# EAGLE design picduino2 (EAGLE 5.06)
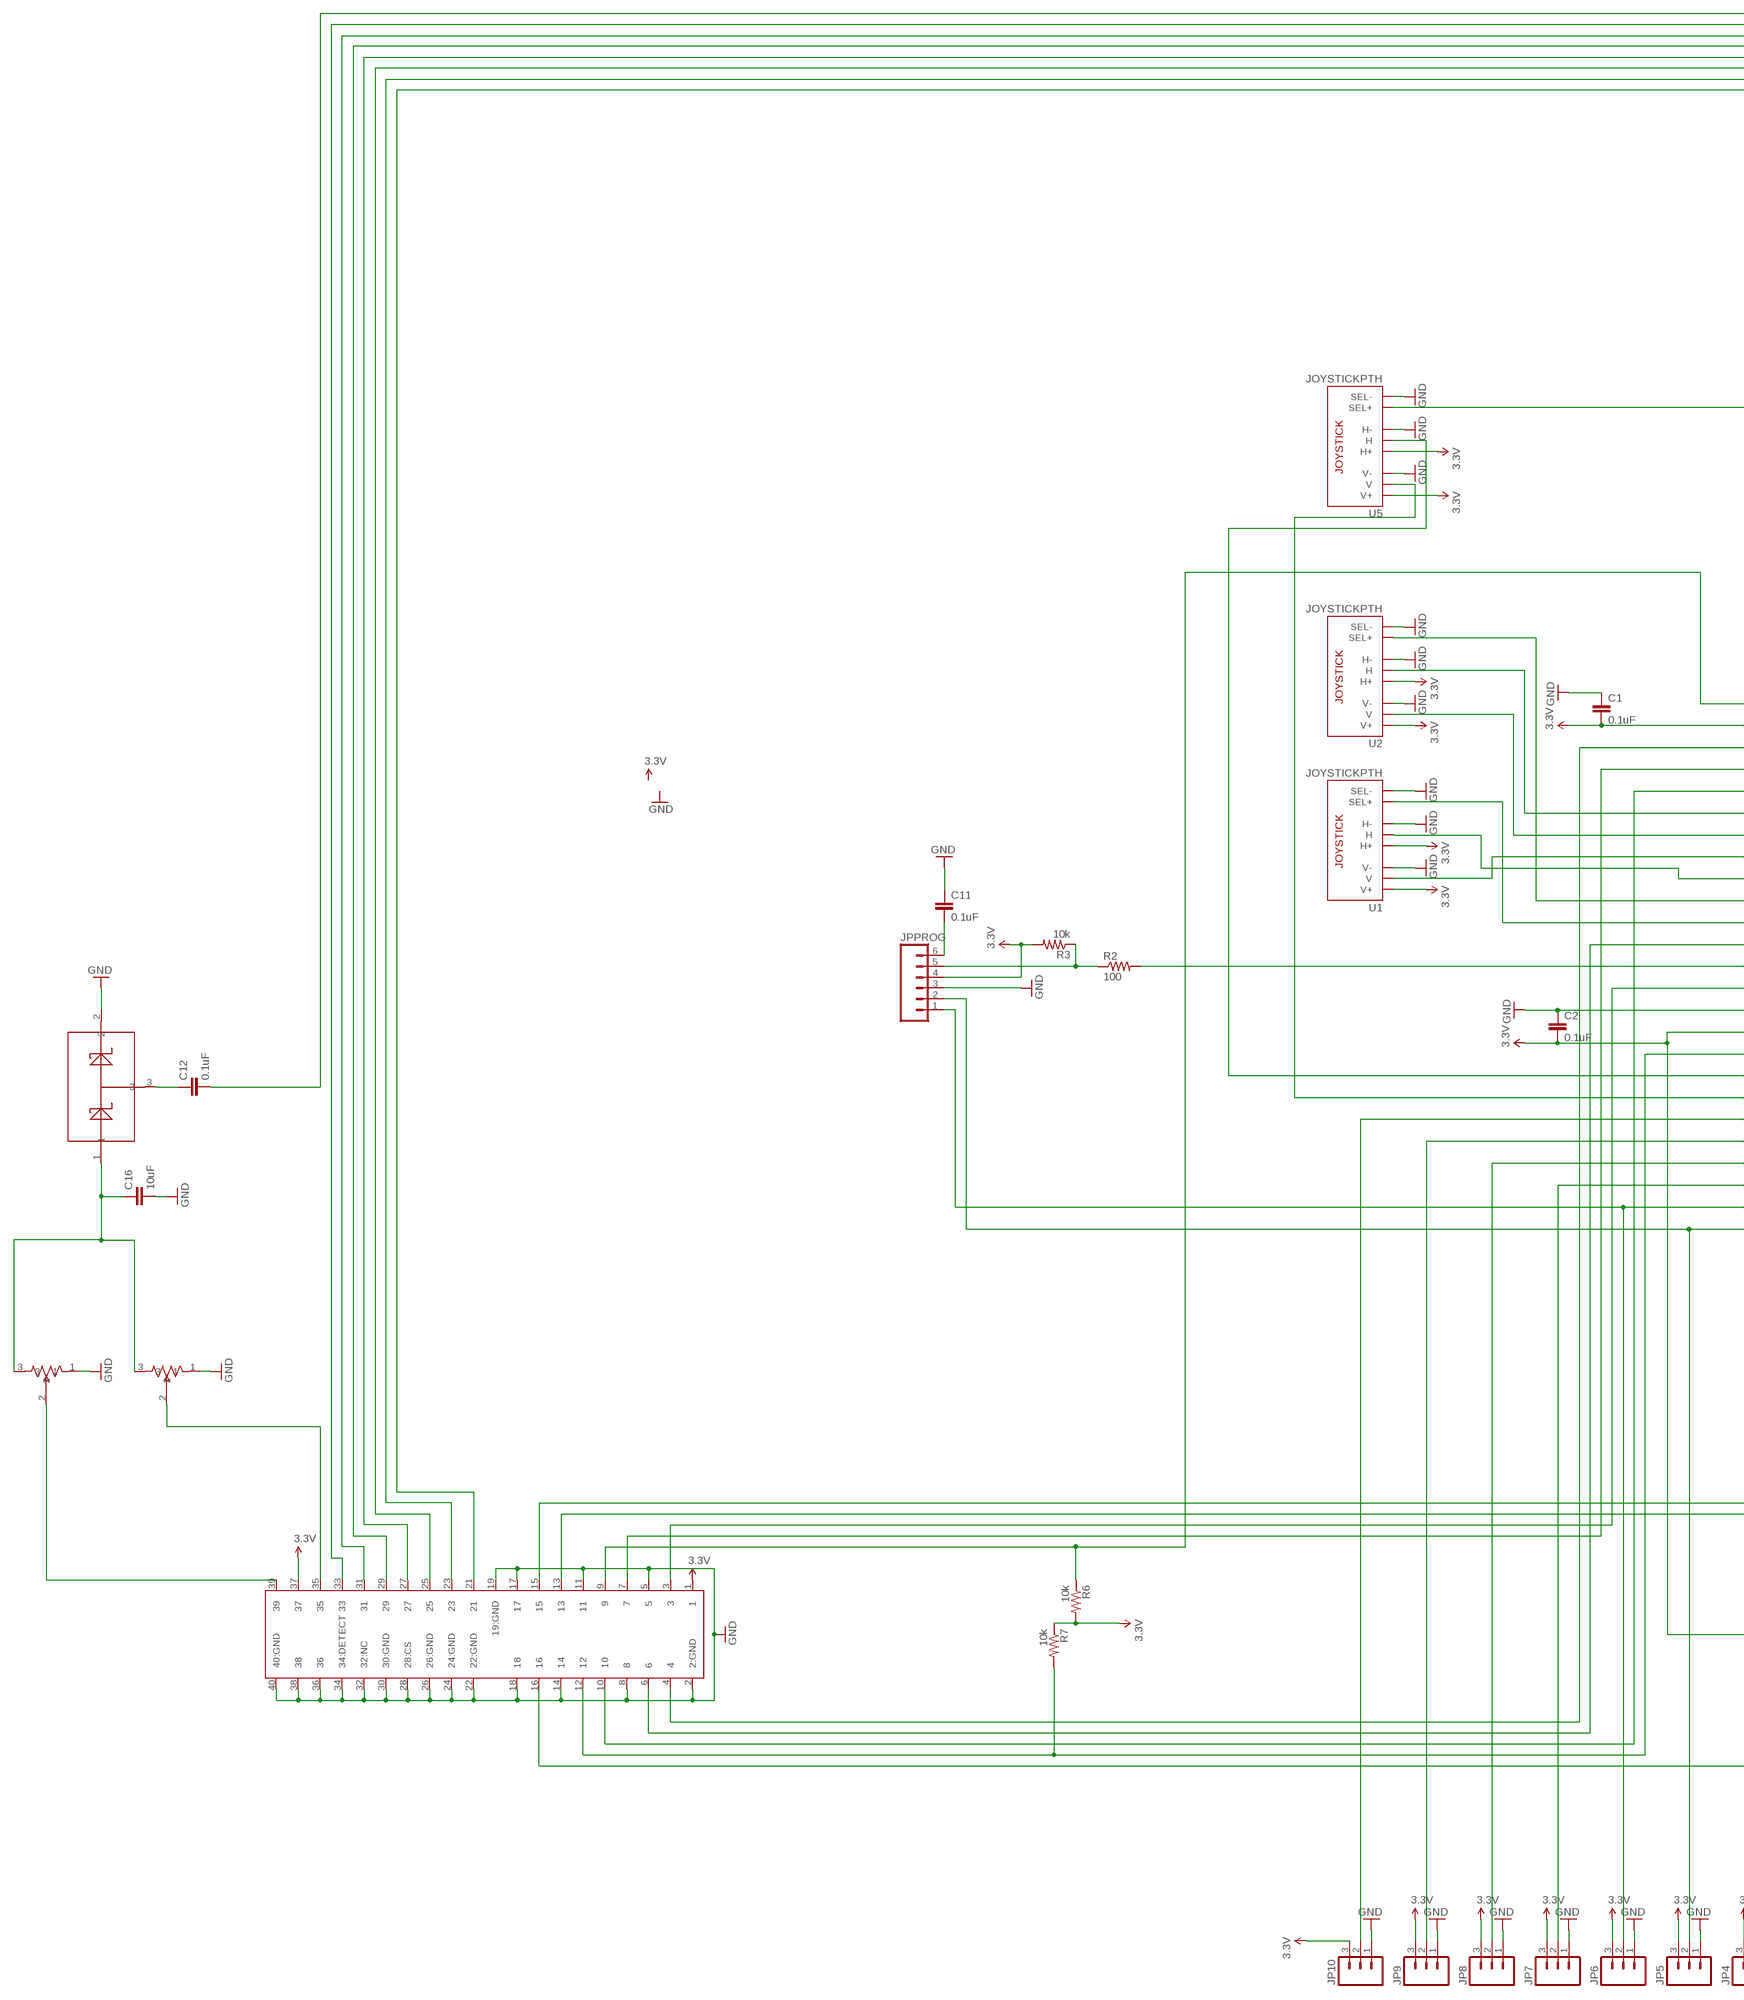
[diagram p0: schematic, sheet 1, part 1 of 2]
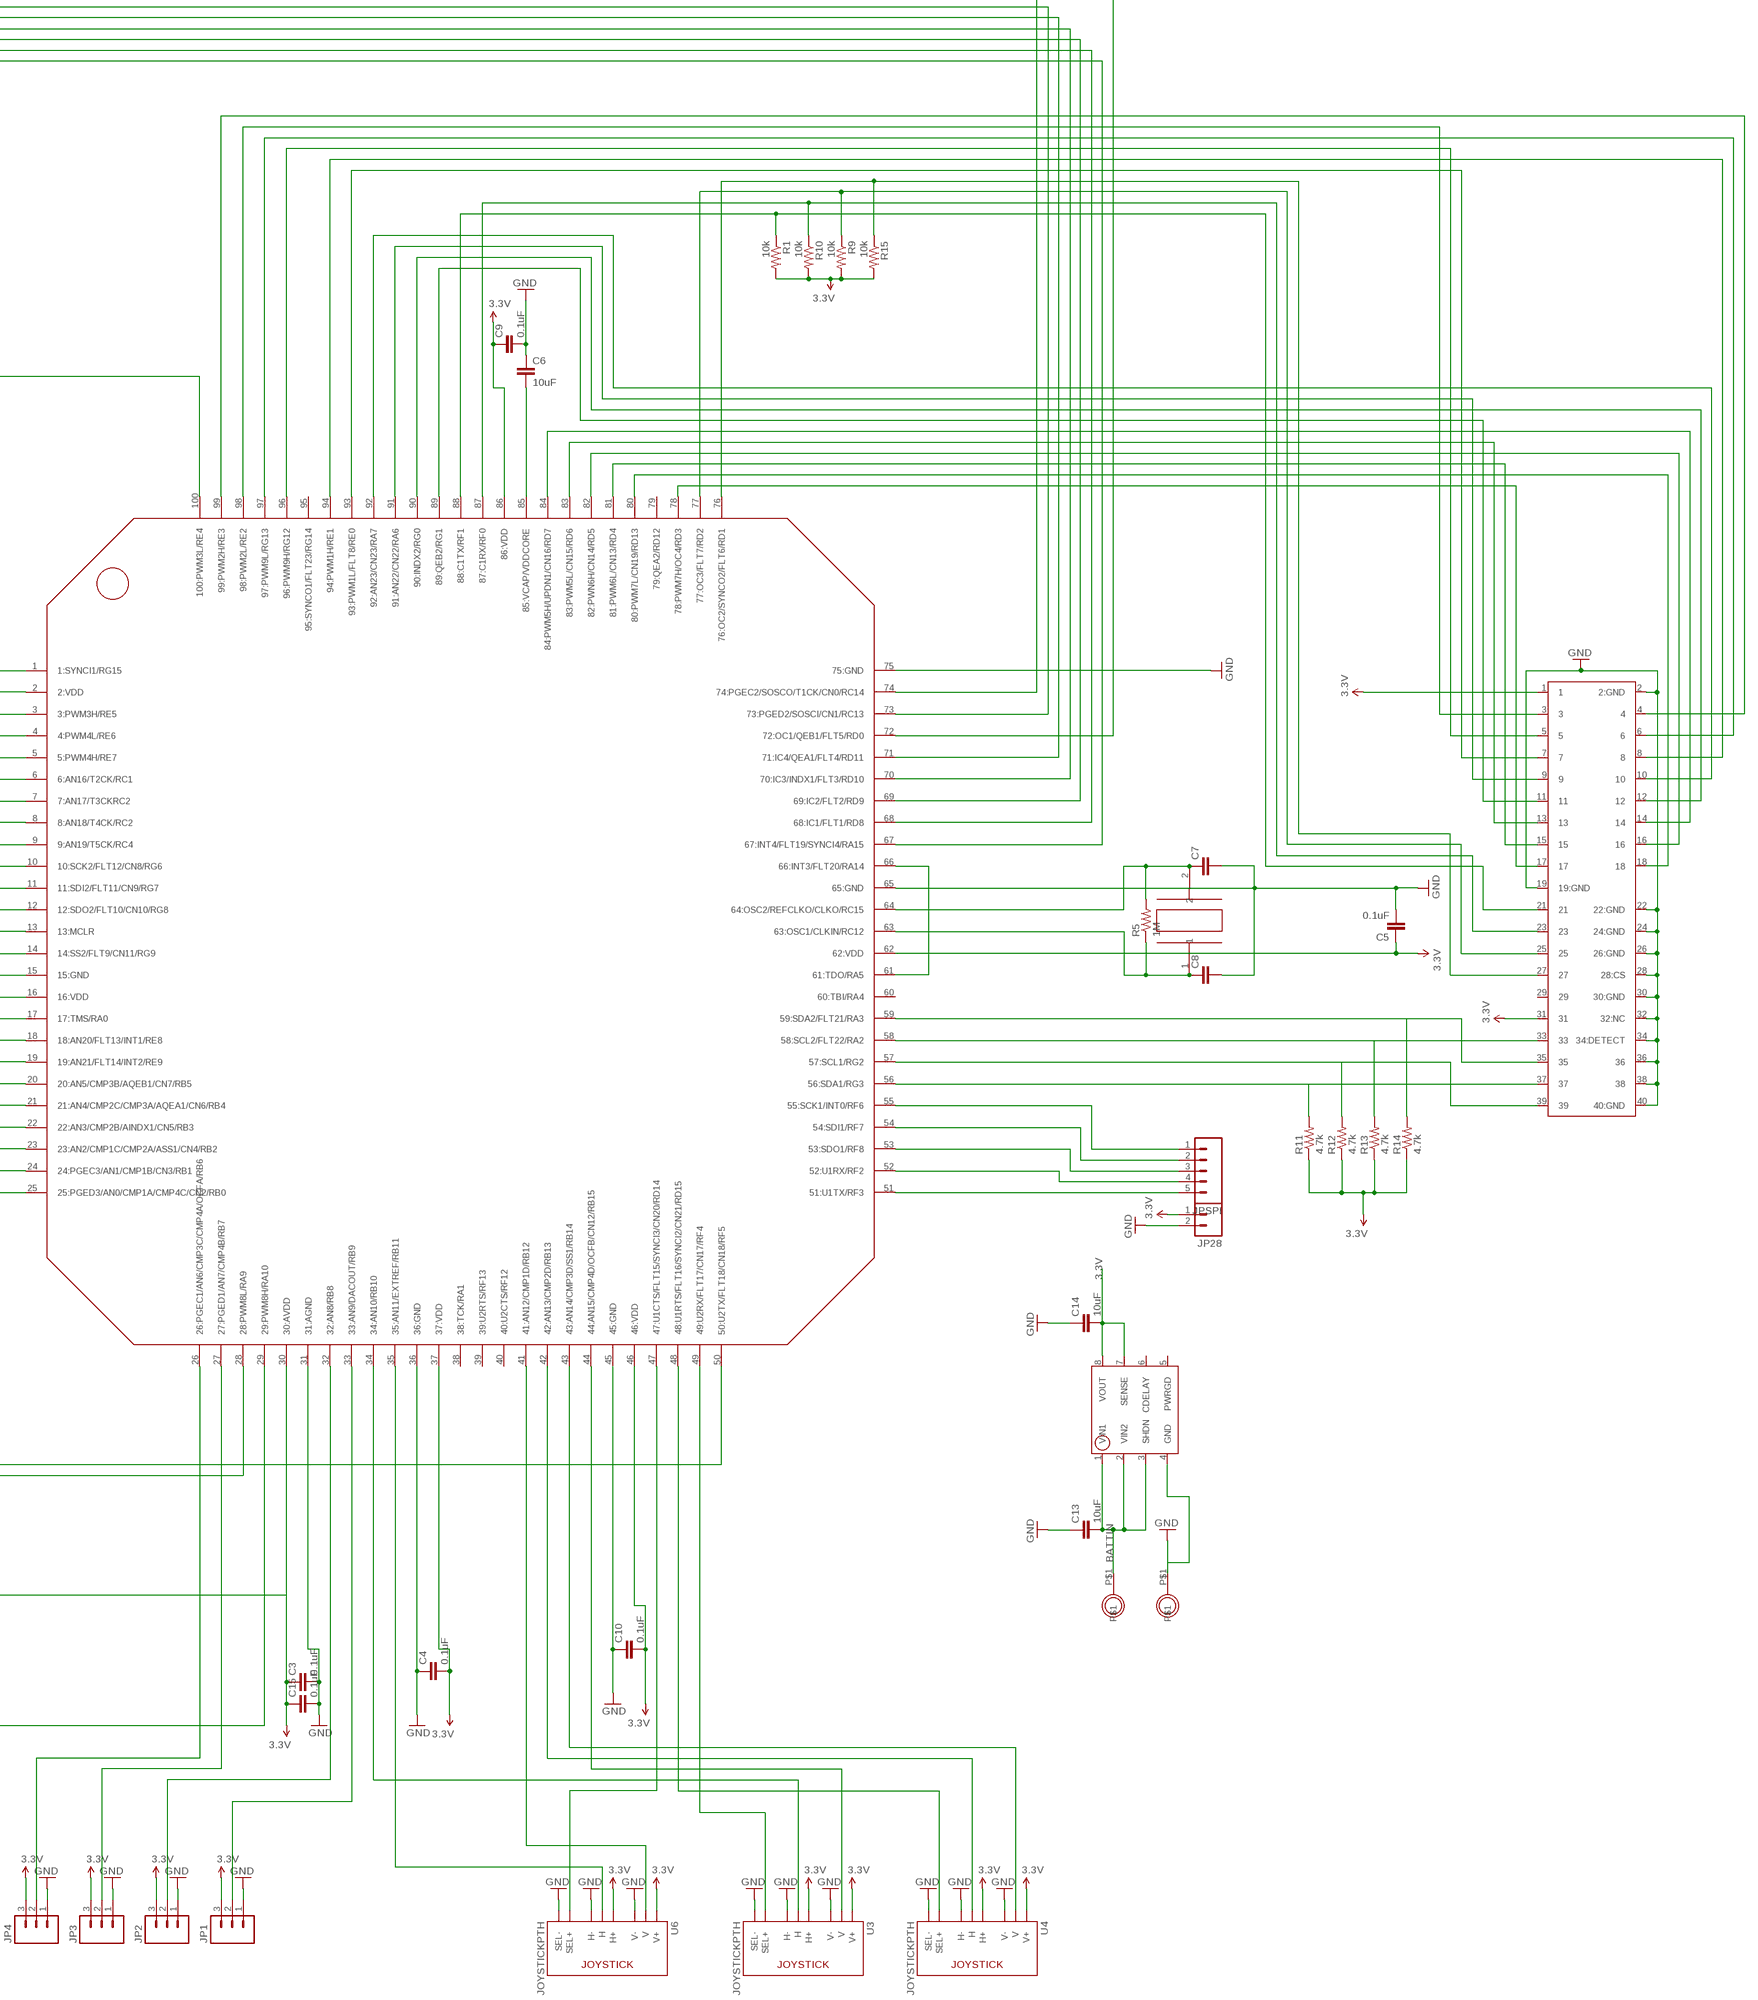
[diagram p1: schematic, sheet 1, part 2 of 2]

## Parts
+  THROUGH_HOLE_1MM  [THROUGH_HOLE_1MM]
-  THROUGH_HOLE_1MM  [THROUGH_HOLE_1MM]
C1  0.1uF  CAP0805  [0805]
C2  0.1uF  CAP0805  [0805]
C3  0.1uF  CAP0805  [0805]
C4  0.1uF  CAP0805  [0805]
C5  0.1uF  CAP0805  [0805]
C6  10uF  CAP0805  [0805]
C7  CAP0402-CAP  [0402-CAP]
C8  CAP0402-CAP  [0402-CAP]
C9  0.1uF  CAP0805  [0805]
C10  0.1uF  CAP0805  [0805]
C11  0.1uF  CAP0805  [0805]
C12  0.1uF  CAP0805  [0805]
C13  10uF  CAP0805  [0805]
C14  10uF  CAP0805  [0805]
C15  0.1uF  CAP0805  [0805]
C16  10uF  CAP0805  [0805]
JP1  M03LOCK  [1X03_LOCK]
JP2  M03LOCK  [1X03_LOCK]
JP3  M03LOCK  [1X03_LOCK]
JP4  M03LOCK  [1X03_LOCK]
JP5  M03LOCK  [1X03_LOCK]
JP6  M03LOCK  [1X03_LOCK]
JP7  M03LOCK  [1X03_LOCK]
JP8  M03LOCK  [1X03_LOCK]
JP9  M03LOCK  [1X03_LOCK]
JP10  M03LOCK  [1X03_LOCK]
JP28  M02LOCK  [1X02_LOCK]
JPPROG  M06LOCK  [1X06_LOCK]
JPSPI  M05LOCK  [1X05_LOCK]
R1  10k  RESISTOR  [0805]
R2  100  RESISTOR  [0805]
R3  10k  RESISTOR  [0805]
R5  1M  RESISTOR  [0805]
R6  10k  RESISTOR  [0805]
R7  10k  RESISTOR  [0805]
R9  10k  RESISTOR  [0805]
R10  10k  RESISTOR  [0805]
R11  4.7k  RESISTOR  [0805]
R12  4.7k  RESISTOR  [0805]
R13  4.7k  RESISTOR  [0805]
R14  4.7k  RESISTOR  [0805]
R15  10k  RESISTOR  [0805]
U1  JOYSTICKPTH  [JOYSTICK]
U2  JOYSTICKPTH  [JOYSTICK]
U3  JOYSTICKPTH  [JOYSTICK]
U4  JOYSTICKPTH  [JOYSTICK]
U5  JOYSTICKPTH  [JOYSTICK]
U6  JOYSTICKPTH  [JOYSTICK]
U$2  BAS40-04  [SOT23]
U$3  HC49US  [HC49US]
U$4  IDEATTACH  [IDEATTACH]
U$6  PIC33FJGS610-14X14  [TQFP100-14X14]
U$10  TRIMPOT3319  [TRIMPOT3319]
U$11  TRIMPOT3319  [TRIMPOT3319]
U$12  IDEATTACH  [IDEATTACH]
U$16  MCP1725  [SOIC8]

## Nets
3.3V: C1.2 C2.2 C3.1 C4.2 C5.1 C9.1 C10.2 C14.2 C15.1 JP1.3 JP2.3 JP3.3 JP4.3 JP5.3 JP6.3 JP7.3 JP8.3 JP9.3 JP10.3 JP28.1 JPPROG.4 R1.2 R3.2 R6.2 R7.1 R9.2 R10.2 R11.1 R12.1 R13.1 R14.1 R15.2 U1.H1(H+) U1.V1(V+) U2.H1(H+) U2.V1(V+) U3.H1(H+) U3.V1(V+) U4.H1(H+) U4.V1(V+) U5.H1(H+) U5.V1(V+) U6.H1(H+) U6.V1(V+) U$4.1 U$4.37 U$6.2(2:VDD) U$6.16(16:VDD) U$6.30(30:AVDD) U$6.37(37:VDD) U$6.46(46:VDD) U$6.62(62:VDD) U$6.86(86:VDD) U$12.1 U$12.31 U$16.7(SENSE) U$16.8(VOUT)
BATTIN: +.P$1 C13.2 U$16.1(VIN1) U$16.2(VIN2) U$16.3(SHDN)
CHARGEPUMP: C16.1 U$2.1 U$10.3 U$11.3
CHARGEPUMPPWM: C12.2 U$6.72(72:OC1/QEB1/FLT5/RD0)
GND: -.P$1 C1.1 C2.1 C3.2 C4.1 C5.2 C6.1 C7.2 C8.2 C9.2 C10.1 C11.1 C13.1 C14.1 C15.2 C16.2 JP1.1 JP2.1 JP3.1 JP4.1 JP5.1 JP6.1 JP7.1 JP8.1 JP9.1 JP10.1 JP28.2 JPPROG.3 U1.B2A(SEL-) U1.H3(H-) U1.V3(V-) U2.B2A(SEL-) U2.H3(H-) U2.V3(V-) U3.B2A(SEL-) U3.H3(H-) U3.V3(V-) U4.B2A(SEL-) U4.H3(H-) U4.V3(V-) U5.B2A(SEL-) U5.H3(H-) U5.V3(V-) U6.B2A(SEL-) U6.H3(H-) U6.V3(V-) U$2.2 U$4.2(2:GND) U$4.5 U$4.8 U$4.11 U$4.14 U$4.17 U$4.18 U$4.19(19:GND) U$4.22(22:GND) U$4.24(24:GND) U$4.26(26:GND) U$4.28(28:CS) U$4.30(30:GND) U$4.32(32:NC) U$4.34(34:DETECT) U$4.36 U$4.38 U$4.40(40:GND) U$6.15(15:GND) U$6.31(31:AGND) U$6.36(36:GND) U$6.45(45:GND) U$6.65(65:GND) U$6.75(75:GND) U$10.1 U$11.1 U$12.2(2:GND) U$12.19(19:GND) U$12.22(22:GND) U$12.24(24:GND) U$12.26(26:GND) U$12.28(28:CS) U$12.30(30:GND) U$12.32(32:NC) U$12.34(34:DETECT) U$12.36 U$12.38 U$12.40(40:GND) U$16.4(GND)
INT: JPSPI.4 U$6.52(52:U1RX/RF2)
J1S: U4.B1A(SEL+) U$6.48(48:U1RTS/FLT16/SYNCI2/CN21/RD15)
J1X: U4.H2(H) U$6.42(42:AN13/CMP2D/RB13)
J1Y: U4.V2(V) U$6.43(43:AN14/CMP3D/SS1/RB14)
J2S: U3.B1A(SEL+) U$6.49(49:U2RX/FLT17/CN17/RF4)
J2X: U3.H2(H) U$6.34(34:AN10/RB10)
J2Y: U3.V2(V) U$6.44(44:AN15/CMP4D/OCFB/CN12/RB15)
J3S: U1.B1A(SEL+) U$6.11(11:SDI2/FLT11/CN9/RG7)
J3X: U1.V2(V) U$6.8(8:AN18/T4CK/RC2)
J4S: U2.B1A(SEL+) U$6.10(10:SCK2/FLT12/CN8/RG6)
J4X: U2.H2(H) U$6.6(6:AN16/T2CK/RC1)
J4Y: U2.V2(V) U$6.7(7:AN17/T3CKRC2)
LCDD4: U$4.27 U$6.70(70:IC3/INDX1/FLT3/RD10)
LCDD5: U$4.25 U$6.69(69:IC2/FLT2/RD9)
LCDD6: U$4.23 U$6.68(68:IC1/FLT1/RD8)
LCDD7: U$4.21 U$6.67(67:INT4/FLT19/SYNCI4/RA15)
LCDDRIVE: U$4.35 U$11.2
LCDE: U$4.29 U$6.71(71:IC4/QEA1/FLT4/RD11)
LCDLED: U$4.39 U$10.2
LCDR/W: U$4.31 U$6.73(73:PGED2/SOSCI/CN1/RC13)
LCDRS: U$4.33 U$6.74(74:PGEC2/SOSCO/T1CK/CN0/RC14)
MCLR: R2.2 U$6.13(13:MCLR)
N$1: U$6.78(78:PWM7H/OC4/RD3) U$12.17
N$3: C12.1 U$2.3
N$4: JPPROG.5 R2.1 R3.1
N$5: U$6.80(80:PWM7L/CN19/RD13) U$12.18
N$6: U$6.81(81:PWM6L/CN13/RD4) U$12.15
N$7: R7.2 U$4.12 U$6.17(17:TMS/RA0)
N$9: U$6.82(82:PWN6H/CN14/RD5) U$12.16
N$10: U$4.16 U$6.29(29:PWM8H/RA10)
N$11: U$6.83(83:PWM5L/CN15/RD6) U$12.13
N$12: U$6.84(84:PWM5H/UPDN1/CN16/RD7) U$12.14
N$13: U$4.13 U$6.28(28:PWM8L/RA9)
N$14: U$4.15 U$6.50(50:U2TX/FLT18/CN18/RF5)
N$15: U$6.89(89:QEB2/RG1) U$12.11
N$16: U$6.90(90:INDX2/RG0) U$12.12
N$17: U$6.91(91:AN22/CN22/RA6) U$12.9
N$18: U$6.92(92:AN23/CN23/RA7) U$12.10
N$19: U$6.93(93:PWM1L/FLT8/RE0) U$12.7
N$20: U$6.94(94:PWM1H/RE1) U$12.8
N$21: U$6.96(96:PWM9H/RG12) U$12.5
N$23: U$6.97(97:PWM9L/RG13) U$12.6
N$24: U$6.98(98:PWM2L/RE2) U$12.3
N$25: U$6.99(99:PWM2H/RE3) U$12.4
N$26: U5.B1A(SEL+) U$6.100(100:PWM3L/RE4)
N$27: R1.1 U$6.88(88:C1TX/RF1) U$12.21
N$28: R10.1 U$6.87(87:C1RX/RF0) U$12.23
N$29: R9.1 U$6.77(77:OC3/FLT7/RD2) U$12.25
N$30: R15.1 U$6.76(76:OC2/SYNCO2/FLT6/RD1) U$12.27
N$31: U1.H2(H) U$6.9(9:AN19/T5CK/RC4)
N$32: U6.B1A(SEL+) U$6.47(47:U1CTS/FLT15/SYNCI3/CN20/RD14)
N$33: U$6.61(61:TDO/RA5) U$6.66(66:INT3/FLT20/RA14)
N$39: R6.1 U$4.9 U$6.1(1:SYNCI1/RG15)
N$40: U$4.4 U$6.3(3:PWM3H/RE5)
N$41: U$4.6 U$6.12(12:SDO2/FLT10/CN10/RG8)
N$42: U$4.7 U$6.4(4:PWM4L/RE6)
N$43: U$4.3 U$6.14(14:SS2/FLT9/CN11/RG9)
N$44: U$4.10 U$6.5(5:PWM4H/RE7)
N$59: R11.2 U$6.56(56:SDA1/RG3) U$12.37
N$60: R12.2 U$6.57(57:SCL1/RG2) U$12.39
N$61: R13.2 U$6.58(58:SCL2/FLT22/RA2) U$12.33
N$62: R14.2 U$6.59(59:SDA2/FLT21/RA3) U$12.35
OSC1: C8.1 R5.1 U$3.1 U$6.63(63:OSC1/CLKIN/RC12)
OSC2: C7.1 R5.2 U$3.2 U$6.64(64:OSC2/REFCLKO/CLKO/RC15)
P1: U6.V2(V) U$6.41(41:AN12/CMP1D/RB12)
P2: U6.H2(H) U$6.35(35:AN11/EXTREF/RB11)
P3: JP1.2 U$6.33(33:AN9/DACOUT/RB9)
P4: JP2.2 U$6.32(32:AN8/RB8)
P5: JP3.2 U$6.27(27:PGED1/AN7/CMP4B/RB7)
P6: JP4.2 U$6.26(26:PGEC1/AN6/CMP3C/CMP4A/OCFA/RB6)
P7: JP5.2 JPPROG.2 U$6.25(25:PGED3/AN0/CMP1A/CMP4C/CN2/RB0)
P8: JP6.2 JPPROG.1 U$6.24(24:PGEC3/AN1/CMP1B/CN3/RB1)
P9: JP7.2 U$6.23(23:AN2/CMP1C/CMP2A/ASS1/CN4/RB2)
P10: JP8.2 U$6.22(22:AN3/CMP2B/AINDX1/CN5/RB3)
P11: JP9.2 U$6.21(21:AN4/CMP2C/CMP3A/AQEA1/CN6/RB4)
P12: JP10.2 U$6.20(20:AN5/CMP3B/AQEB1/CN7/RB5)
P13: U5.V2(V) U$6.19(19:AN21/FLT14/INT2/RE9)
P14: U5.H2(H) U$6.18(18:AN20/FLT13/INT1/RE8)
PROGCAP: C11.2 JPPROG.6
RESET: JPSPI.5 U$6.51(51:U1TX/RF3)
SCK: JPSPI.1 U$6.55(55:SCK1/INT0/RF6)
SDI: JPSPI.2 U$6.54(54:SDI1/RF7)
SDO: JPSPI.3 U$6.53(53:SDO1/RF8)
VDDCORE: C6.2 U$6.85(85:VCAP/VDDCORE)
Unconnected: U$6.38(38:TCK/RA1) U$6.39(39:U2RTS/RF13) U$6.40(40:U2CTS/RF12) U$6.60(60:TBI/RA4) U$6.79(79:QEA2/RD12) U$6.95(95:SYNCO1/FLT23/RG14) U$12.29 U$16.5(PWRGD) U$16.6(CDELAY)

## Library data of the parts
+ - = 1dah:THROUGH_HOLE_1MM
C1-C16 = SparkFun:CAP: Capacitor Standard 0603 ceramic capacitor, and 0.1" leaded capacitor.
JP1-JP10 = SparkFun:M03: Header 3 Standard 3-pin 0.1" header. Use with straight break away headers (SKU : PRT-00116), right angle break away headers (PRT-00553), swiss pins (PRT-00743), machine pins (PRT-00117), and female headers (PRT-00115). Molex polarized connector foot print use with SKU : PRT-08232 with associated crimp pins and housings.
JP28 = SparkFun:M02: Header 2 Standard 2-pin 0.1" header. Use with straight break away headers (SKU : PRT-00116), right angle break away headers (PRT-00553), swiss pins (PRT-00743), machine pins (PRT-00117), and female headers (PRT-00115). Molex polarized connector foot print use with SKU : PRT-08233 with associated crimp pins and housings.
JPPROG = SparkFun:M06: Header 6 Standard 6-pin 0.1" header. Use with straight break away headers (SKU : PRT-00116), right angle break away headers (PRT-00553), swiss pins (PRT-00743), machine pins (PRT-00117), and female headers (PRT-00115). Molex polarized connector foot print use with SKU : PRT-08094 with associated crimp pins and housings. NOTES ON THE VARIANTS LOCK and LOCK_LONGPADS... This footprint was designed to help hold the alignment of a through-hole component (i.e. 6-pin header) while soldering it into place. You may notice that each hole has been shifted either up or down by 0.005 of an inch from it's more standard position (which is a perfectly straight line). This slight alteration caused the pins (the squares in the middle) to touch the edges of the holes. Because they are alternating, it causes a "brace" to hold the component in place. 0.005 has proven to be the perfect amount of "off-center" position when using our standard breakaway headers. Although looks a little odd when you look at the bare footprint, once you have a header in there, the alteration is very hard to notice. Also, if you push a header all the way into place, it is covered up entirely on the bottom side. This idea of altering the position of holes to aid alignment will be further integrated into the Sparkfun Library for other footprints. It can help hold any component with 3 or more connection pins.
JPSPI = SparkFun:M05: Header 5 Standard 5-pin 0.1" header. Use with straight break away headers (SKU : PRT-00116), right angle break away headers (PRT-00553), swiss pins (PRT-00743), machine pins (PRT-00117), and female headers (PRT-00115). Molex polarized connector foot print use with SKU : PRT-08230 with associated crimp pins and housings.
R1-R3 R5-R7 R9-R15 = SparkFun:RESISTOR: Resistor Basic schematic elements and footprints for 0603, 1206, and PTH 1/10th watt (small) resistors.
U1-U6 = SparkFun:JOYSTICK: Thumb Joystick Joystick commonly found in PS2 controllers. Two pots and a select switch. Footprint proven. Spark Fun Electronics SKU : COM-09032
U$2 = 1dah:BAS40-04: 2 Schottky diodes
U$3 = 1dah:HC49US: 16 MHz crystal
U$4 U$12 = 1dah:IDEATTACH
U$6 = 1dah:PIC33FJGS610-14X14
U$10 U$11 = 1dah:TRIMPOT3319: Bournes Trimpot
U$16 = 1dah:MCP1725: LDO power supply 500mA

## Board
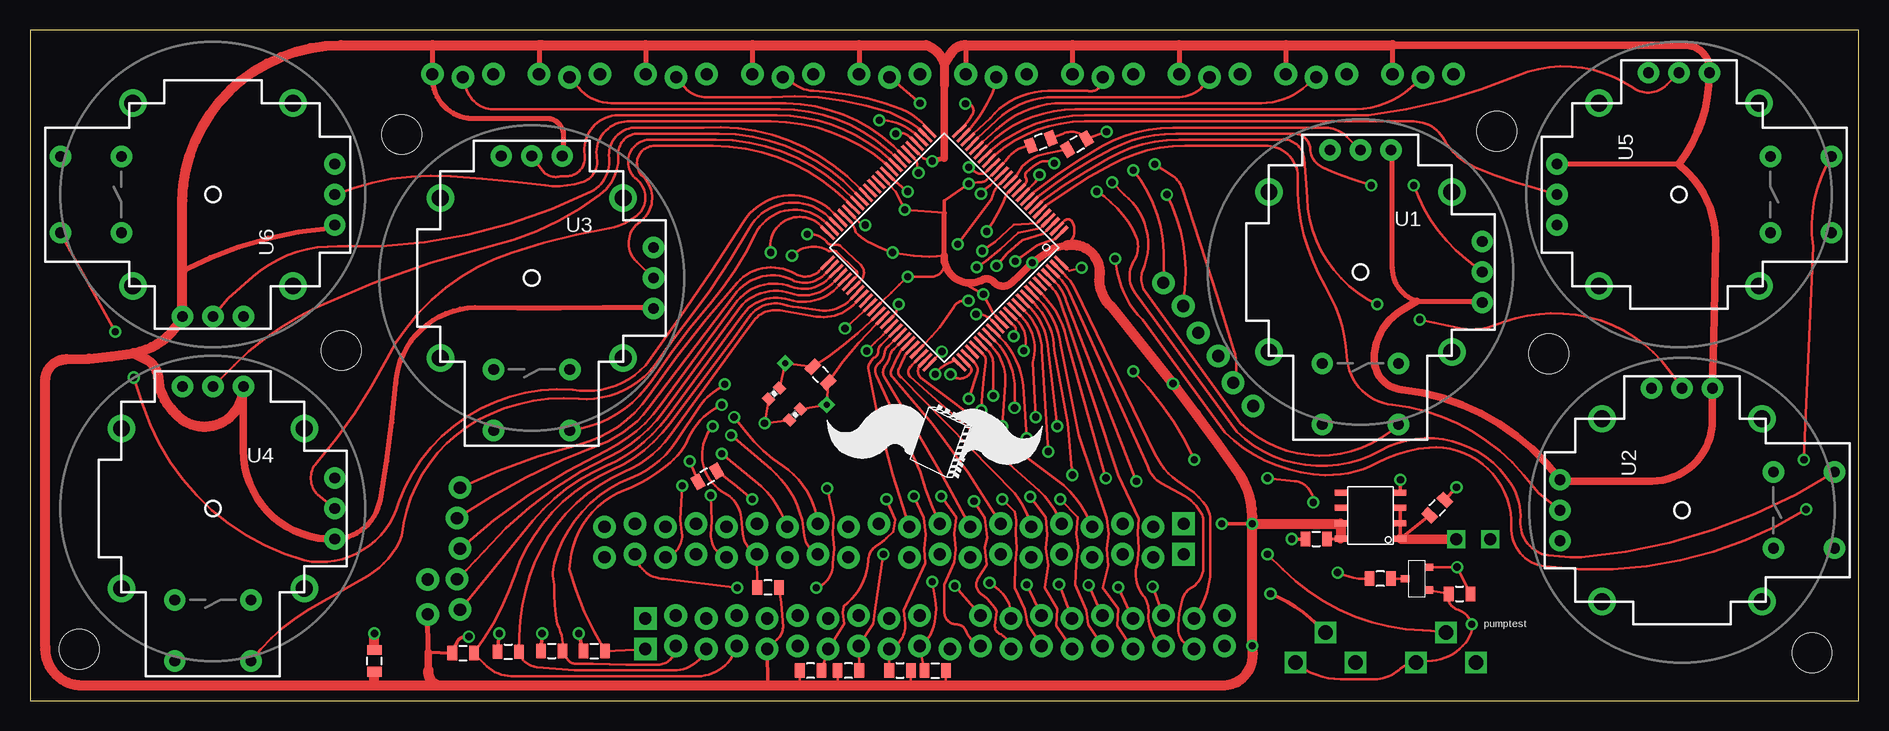
[diagram p2: board, top side]
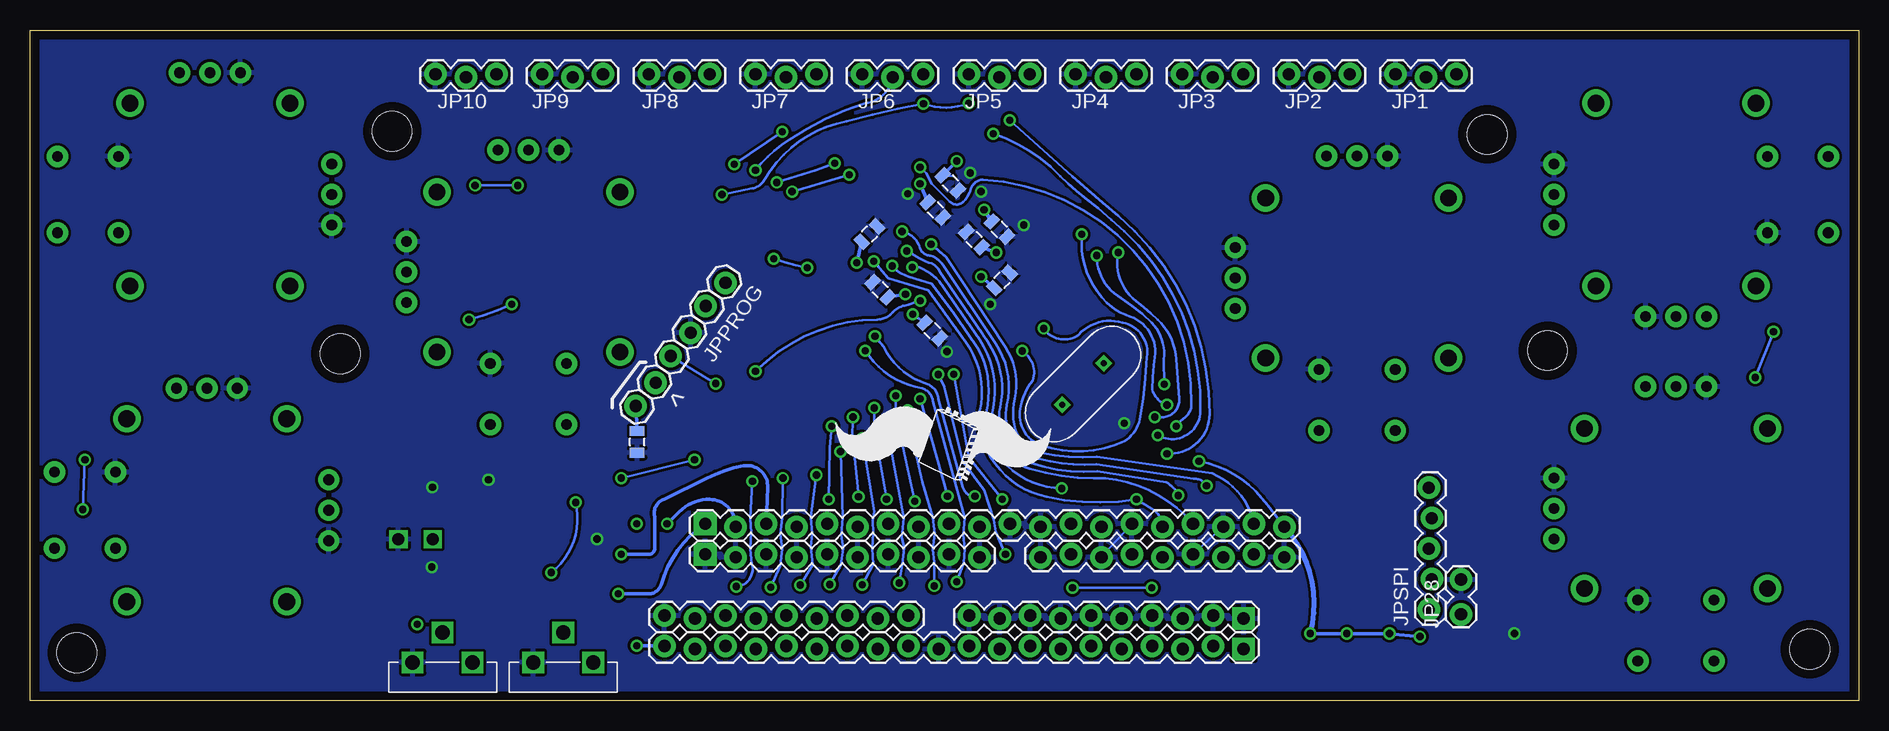
[diagram p3: board, bottom side, seen from below]

Size 152.41 x 55.88 mm. Coordinates in mm from the lower left corner, seen from the top.
Outline: 0,0 152.38,0 152.4,33.02 152.41,55.88 134.62,55.88 17.78,55.88 0,55.88 0,0
Copper layers (1*16): Top 0.035mm / dielectric 1.5mm / Bottom 0.035mm
Design rules "goldenpcb *": minimum track width 9mil, minimum drill 18mil, track to track 9mil, track to pad 8mil, pad to pad 9mil, via to via 9mil, smd to smd 9mil, copper to edge 30mil, drill to drill 9mil, minimum pad ring 10mil, minimum via ring 8mil, stop-mask expansion 4mil, vias tented up to drill 0mil, thermal gap 10mil

### Footprints (pad centres in the part's own frame; a part is rotated, then mirrored left to right if it is on the bottom)
THROUGH_HOLE_1MM = drill 1 square: P$1 0,0
0805 = smd 0.8 x 1.2: 1 -0.9,0; 2 0.9,0
0402-CAP = smd 0.7 x 0.9: 1 -0.65,0; 2 0.65,0
1X03_LOCK = drill 1.016 pad 1.88 round: 1 0,0.127; 2 2.54,-0.127; 3 5.08,0.127
1X02_LOCK = drill 1.016 pad 1.88 round: 1 -0.178,0; 2 2.718,0
1X06_LOCK = drill 1.016 pad 1.88 round: 1 0,0; 2 2.54,-0.254; 3 5.08,0; 4 7.62,-0.254; 5 10.16,0; 6 12.7,-0.254
1X05_LOCK = drill 1.016 pad 1.88 round: 1 0,0.127; 2 2.54,-0.127; 3 5.08,0.127; 4 7.62,-0.127; 5 10.16,0.127
JOYSTICK = drill 0.9 pad 1.778 round: B1A -3.175,12.7; B1B 3.175,12.7; B2A -3.175,7.62; B2B 3.175,7.62 | drill 0.889 pad 1.778 round: H1 -2.54,-10.16; H2 0,-10.16; H3 2.54,-10.16; V1 -10.16,2.54; V2 -10.16,0; V3 -10.16,-2.54 | drill 1.397 pad 2.286 round: MOUNT1 -7.62,6.668; MOUNT2 -7.62,-6.668; MOUNT3 7.62,-6.668; MOUNT4 7.62,6.668
STAND-OFF = hole 3.302: 0,0
SOT23 = smd 0.6 x 0.7: 1 0.95,1; 2 -0.95,1; 3 0,-1
HC49US = drill 0.5 square: 1 -2.44,0; 2 2.44,0
IDEATTACH = drill 1.016 pad 1.88 round: 1 48.26,-0.127; 2 48.26,-2.667; 3 45.72,0.127; 4 45.72,-2.413; 5 43.18,-0.127; 6 43.18,-2.667; 7 40.64,0.127; 8 40.64,-2.413; 9 38.1,-0.127; 10 38.1,-2.667; 11 35.56,0.127; 12 35.56,-2.413; 13 33.02,-0.127; 14 33.02,-2.667; 15 30.48,0.127; 16 30.48,-2.413; 17 27.94,-0.127; 18 27.94,-2.667; 19 25.4,0.127; 21 22.86,-0.127; 22 22.86,-2.667; 23 20.32,0.127; 24 20.32,-2.413; 25 17.78,-0.127; 26 17.78,-2.667; 27 15.24,0.127; 28 15.24,-2.413; 29 12.7,-0.127; 30 12.7,-2.667; 31 10.16,0.127; 32 10.16,-2.413; 33 7.62,-0.127; 34 7.62,-2.667; 35 5.08,0.127; 36 5.08,-2.413; 37 2.54,-0.127; 38 2.54,-2.667 | drill 1.016 pad 1.88 square: 39 0,0.127; 40 0,-2.413
TQFP100-14X14 = smd 1.5 x 0.25: 1 -7.75,6; 2 -7.75,5.5; 3 -7.75,5; 4 -7.75,4.5; 5 -7.75,4; 6 -7.75,3.5; 7 -7.75,3; 8 -7.75,2.5; 9 -7.75,2; 10 -7.75,1.5; 11 -7.75,1; 12 -7.75,0.5; 13 -7.75,0; 14 -7.75,-0.5; 15 -7.75,-1; 16 -7.75,-1.5; 17 -7.75,-2; 18 -7.75,-2.5; 19 -7.75,-3; 20 -7.75,-3.5; 21 -7.75,-4; 22 -7.75,-4.5; 23 -7.75,-5; 24 -7.75,-5.5; 25 -7.75,-6; 51 7.75,-6; 52 7.75,-5.5; 53 7.75,-5; 54 7.75,-4.5; 55 7.75,-4; 56 7.75,-3.5; 57 7.75,-3; 58 7.75,-2.5; 59 7.75,-2; 60 7.75,-1.5; 61 7.75,-1; 62 7.75,-0.5; 63 7.75,0; 64 7.75,0.5; 65 7.75,1; 66 7.75,1.5; 67 7.75,2; 68 7.75,2.5; 69 7.75,3; 70 7.75,3.5; 71 7.75,4; 72 7.75,4.5; 73 7.75,5; 74 7.75,5.5; 75 7.75,6 | smd 0.25 x 1.5: 26 -6,-7.75; 27 -5.5,-7.75; 28 -5,-7.75; 29 -4.5,-7.75; 30 -4,-7.75; 31 -3.5,-7.75; 32 -3,-7.75; 33 -2.5,-7.75; 34 -2,-7.75; 35 -1.5,-7.75; 36 -1,-7.75; 37 -0.5,-7.75; 38 0,-7.75; 39 0.5,-7.75; 40 1,-7.75; 41 1.5,-7.75; 42 2,-7.75; 43 2.5,-7.75; 44 3,-7.75; 45 3.5,-7.75; 46 4,-7.75; 47 4.5,-7.75; 48 5,-7.75; 49 5.5,-7.75; 50 6,-7.75; 76 6,7.75; 77 5.5,7.75; 78 5,7.75; 79 4.5,7.75; 80 4,7.75; 81 3.5,7.75; 82 3,7.75; 83 2.5,7.75; 84 2,7.75; 85 1.5,7.75; 86 1,7.75; 87 0.5,7.75; 88 0,7.75; 89 -0.5,7.75; 90 -1,7.75; 91 -1.5,7.75; 92 -2,7.75; 93 -2.5,7.75; 94 -3,7.75; 95 -3.5,7.75; 96 -4,7.75; 97 -4.5,7.75; 98 -5,7.75; 99 -5.5,7.75; 100 -6,7.75
TRIMPOT3319 = drill 1.2 square: 1 -2.5,0; 2 0,2.5; 3 2.5,0
SOIC8 = smd 1 x 0.5: 1 -2.5,1.92; 2 -2.5,0.64; 3 -2.5,-0.64; 4 -2.5,-1.92; 5 2.48,-1.92; 6 2.48,-0.64; 7 2.48,0.64; 8 2.48,1.92

### Placement (x,y rotation side)
+  118.86,13.45 0 top
-  121.7,13.45 0 top
C1  82.45,38.88 225 bottom
C2  76.96,40.89 135 bottom
C3  75.72,43.14 315 bottom
C4  71.63,39.29 135 bottom
C5  71.41,35.02 45 bottom
C6  77.22,30.84 135 bottom
C7  63.76,23.83 225 top
C8  62,25.59 225 top
C9  81.55,34.23 135 bottom
C10  73.73,38.43 315 bottom
C11  101.82,21.55 90 bottom
C12  112.52,10.16 180 top
C13  117.27,16.08 225 top
C14  107.19,13.46 0 top
C15  28.7,3.3 90 top
C16  119.13,8.89 0 top
JP1  38.61,52.07 0 bottom
JP2  47.5,52.07 0 bottom
JP3  56.39,52.07 0 bottom
JP4  65.28,52.07 0 bottom
JP5  74.17,52.07 0 bottom
JP6  83.06,52.07 0 bottom
JP7  91.95,52.07 0 bottom
JP8  100.84,52.07 0 bottom
JP9  109.73,52.07 0 bottom
JP10  118.62,52.07 0 bottom
JP28  33.15,7.37 90 bottom
JPPROG  94.44,34.81 235 bottom
JPSPI  35.71,7.58 90 bottom
R1  75.44,2.49 0 top
R2  87.26,46.38 210 top
R3  84.23,46.56 200 top
R5  65.88,27.16 315 top
R6  56.45,18.68 210 top
R7  61.51,9.42 180 top
R9  68.21,2.49 180 top
R10  72.51,2.51 0 top
R11  43.48,4.13 0 top
R12  47.02,4.12 0 top
R13  36.09,3.95 0 top
R14  39.85,4.07 0 top
R15  65.05,2.49 180 top
U1  110.87,35.71 180 top
U2  137.67,15.86 270 top
U3  41.81,35.21 180 top
U4  15.24,16 180 top
U5  137.41,42.16 270 top
U6  15.24,42.16 90 top
U$1  [STAND-OFF]  4.1,4.27 0 top
U$2  115.57,10.16 270 top
U$3  64.65,26.38 225 bottom
U$4  96.14,14.61 0 bottom
U$5  [STAND-OFF]  30.98,47.18 0 top
U$6  76.2,37.74 225 top
U$7  [STAND-OFF]  122.23,47.45 0 top
U$10  107.96,3.18 0 bottom
U$11  118.02,3.18 0 bottom
U$12  51.27,4.42 180 bottom
U$13  [STAND-OFF]  25.94,29.17 0 top
U$14  [STAND-OFF]  148.5,3.97 0 top
U$15  [STAND-OFF]  126.55,28.9 0 top
U$16  111.7,15.41 180 top
U$17  [MTECHLOGO1]  75.9,21.4 0 top
U$18  [MTECHLOGO1]  75.8,21.18 0 bottom

### Tracks (layer width: path | path; a pad name or v marks a point on that pad's centre or on a via)
3.3V  (via drill 0.6)
  Top 0.229: v75.18,44.96 74.42,45.21 U$6.30 | 76.2,41.66 v78.23,43.06 arc1 78.99,43.18 arc52 79.76,43.43 U$6.16 arc3 81.28,44.96 arc-51 R3.2 | U$6.37 72.14,42.42 v72.9,40.89 76.2,40.64 | U$6.46 68.48,39.8 arc-11 68.81,39.04 arc22 70.1,38.1 arc3 v71.88,37.34 73.66,37.08 arc16 76.2,37.08 | U$6.86 80.26,32.26 v79.45,33.86 arc-10 76.43,35.79 arc-53 76.2,36.58 arc-90 75.18,35.31 v73.15,35.31 arc1 71.07,33.3 U$6.62 | U$12.31 62.23,5.08 arc47 62.76,6.12 62.61,8.15 R7.1 | 64.14,1.27 R15.2 | 67.31,1.27 R9.2 | 73.41,1.27 R10.2 | 76.33,1.27 R1.2 | v54.99,19.94 R6.2 | U$6.2 86.21,39.98 arc-109 86.87,39.88 arc-81 86.39,37.92
  Top 0.305: 76.2,40.64 76.2,41.66 | v101.85,14.73 v99.31,14.73 | 33.17,4.04 R13.1 35.56,4.83 arc-81 v36.58,5.33 | v39.12,5.59 R14.1 | v42.67,5.59 R11.1 | v45.72,5.59 R12.1 | 61.47,1.27 U$12.31 | U$16.8 C14.2
  Top 0.406: 42.42,54.61 JP2.3 | 51.31,54.61 JP3.3 | 60.2,54.61 JP4.3 | 69.09,54.61 JP5.3 | 77.98,54.61 JP6.3 | 86.87,54.61 JP7.3 | 95.76,54.61 JP8.3 | 104.65,54.61 JP9.3 | 113.54,54.61 JP10.3 | U3.H1 44.45,45.37 44.45,47.24 arc90 42.93,48.51 36.83,48.51 arc-92 JP1.3 33.53,54.61 | U3.V1 51.82,32.67 51.82,32.77 47.75,32.77 arc-2 37.08,32.77 arc85 30.48,26.42 arc-5 29.21,16.76 arc-78 U4.V1 | U6.H1 25.15,39.62 25.15,39.37 24.89,39.37 arc23 12.7,35.81 | U1.H1 113.54,45.87 113.54,36.07 arc72 115.57,33.27 120.65,33.27 120.65,33.17 U1.V1 | U2.H1 127.76,18.4 127.76,18.29 | 137.41,44.7 U5.H1 | 76.2,45.21 v75.18,44.96 | 76.2,37.08 76.2,40.64 | 33.17,4.04 JP28.1
  Top 0.61: U4.H1 17.78,20.83 arc92 U4.V1 | 113.54,54.61 137.92,54.61 arc-97 U5.V1 arc-37 137.41,44.7 138.18,43.94 arc-46 140.46,38.35 arc-1 U2.V1 140.21,23.37 arc-90 135.13,18.29 127.76,18.29 | 115.57,33.27 114.3,32.51 arc59 112.01,28.45 arc83 114.3,25.91 arc-47 U2.H1 | 76.2,36.68 76.2,36.58 | 76.2,36.68 76.2,37.08 | 86.39,37.92 85.27,37.69 v83.52,36.47 arc-1 81.89,34.9 arc-93 80.37,34.82 arc70 79.45,35.1 arc-113 76.2,36.68 | 33.2,2.54 33.17,4.04 | 76.2,51.31 76.2,45.21
  Top 0.762: 76.2,53.09 76.2,51.31
  Top 0.813: 42.42,54.61 33.53,54.61 25.91,54.61 arc89 12.7,41.66 arc2 12.7,35.81 U6.V1 arc-53 8.64,28.96 | 42.42,54.61 42.67,54.61 | 42.42,54.61 51.31,54.61 60.2,54.61 69.09,54.61 74.68,54.61 arc-53 76.2,53.09 76.71,53.85 arc-67 77.98,54.61 86.87,54.61 95.76,54.61 104.65,54.61 113.54,54.61 | U4.H1 arc-145 11.94,24.13 arc-41 10.67,26.92 arc59 9.65,28.45 8.64,28.96 | 86.39,37.92 arc-106 89.15,35.56 arc57 90.17,32.77 v95.25,26.42 arc-2 100.84,18.8 arc-36 v101.85,14.73 | v101.85,14.73 v101.85,4.57 arc-18 101.85,3.3 arc-81 99.31,1.27 76.33,1.27 73.41,1.27 67.31,1.27 64.14,1.27 61.47,1.27 34.04,1.27 | 33.2,2.54 arc77 33.98,1.27 34.04,1.27 | v101.85,14.73 109.22,14.73 | 109.22,14.73 U$16.8 | 109.22,14.73 U$16.7 | 28.7,1.27 4.32,1.27 arc-95 1.27,4.57 1.27,26.67 arc-90 3.05,28.45 arc10 8.64,28.96 | 28.7,1.27 34.04,1.27 | 28.7,1.27 C15.1
  Bottom 0.229: C3.1 75.44,43.69 | v95.25,26.42 JPPROG.4 | U$4.1 49.28,16.26 arc-45 v54.99,19.94
  Bottom 0.305: v78.23,43.06 C2.2 | v72.9,40.89 C4.2 | v83.52,36.47 C1.2 | v71.88,37.34 C10.2 | v79.45,33.86 C9.1 | v73.15,35.31 C5.1 | v75.18,44.96 C3.1 | v101.85,4.57 U$12.1 | v36.58,5.33 v39.12,5.59 v42.67,5.59 v45.72,5.59 | v99.31,14.73 98.3,15.75 arc46 95.76,16.76 arc90 U$4.37
  Bottom 0.406: v45.72,5.59 arc-58 U$4.1
BATTIN
  Top 0.305: U$16.3 U$16.2 U$16.1 C13.2
  Top 0.813: U$16.1 +.P$1
CHARGEPUMP  (via drill 0.6)
  Top 0.229: U$2.1 C16.1 arc83 118.87,7.62 arc-60 v120.14,6.35 120.14,5.84 arc-28 119.63,4.83 arc-47 116.84,3.3 U$11.3 arc36 114.05,2.54 arc-42 112.01,1.78 arc1 109.22,1.78 arc-42 U$10.3
CHARGEPUMPPWM  (via drill 0.6)
  Top 0.229: U$6.72 74.45,29.62 arc13 76.96,32.77 arc-76 v78.21,33.33 | v91.95,27.43 arc-20 v97.03,20.07 | v103.12,18.54 105.41,18.29 arc-86 v106.93,16.51 | v108.97,10.67 arc18 110.74,10.16 arc14 C12.2
  Bottom 0.229: v78.21,33.33 arc6 79.53,32.92 arc-37 80.57,32.31 arc48 81.79,31.75 arc-45 v91.95,27.43 | v97.03,20.07 v103.12,18.54 | v106.93,16.51 arc65 v108.97,10.67
GND  (via drill 0.6)
  Top 0.229: U$6.31 73.91,44.96 v74.04,43.97 | U$6.45 69.09,39.88 v69.6,39.62 | U$6.36 71.88,43.43 v73.15,42.42 | U$6.65 72.14,32.26 v72.39,33.02 | U$6.15 80.01,42.93 arc21 v79.25,42.24 | C8.2 v61.21,23.11 C7.2 | U$6.75 v76,29.08 | U$2.2 v118.92,11.12 C16.2
  Top 0.305: U$16.4 v114.2,18.4 | C14.1 v105.16,13.46 | C13.1 v118.87,17.78
  Top 0.813: C15.2 v28.7,5.59
  Bottom 0.229: U$4.8 U$4.5 | U$4.14 U$4.11
  pour Bottom: -12.7,65.79 156.21,65.79 156.21,-12.7 -12.7,-12.7
INT
  Top 0.229: U$6.52 66.17,35.48 arc-71 63.5,35.05 arc82 58.7,33.76 51.56,24.38 arc-32 47.5,21.34 arc13 JPSPI.4
J1S
  Top 0.229: U$6.48 66.57,40.28 arc105 59.94,39.37 arc-8 54.86,31.75 arc4 52.07,27.94 arc-56 45.72,25.15 arc28 38.35,23.88 arc60 30.99,13.72 arc-38 28.19,10.41 arc-2 24.13,8.13 arc24 U4.B1A
J1X
  Top 0.229: U4.H2 17.02,27.94 arc-20 23.88,32.77 arc-12 38.35,37.85 arc24 47.5,42.16 arc56 49.02,45.47 arc-88 50.55,47.24 57.4,47.24 arc-47 68.78,42.32 U$6.42
J1Y
  Top 0.229: U4.V2 24.13,17.02 arc-92 23.88,19.81 arc14 29.72,28.45 arc-45 40.13,37.34 arc-8 48.26,39.37 arc28 50.55,40.39 arc104 50.55,43.43 arc-138 51.56,46.74 57.15,46.74 arc-46 68.43,41.99 U$6.43
J2S
  Top 0.229: U$6.49 66.19,39.93 arc108 60.45,38.86 arc-15 56.64,33.02 arc7 51.82,26.67 arc-49 U3.B1A
J2X
  Top 0.229: U3.H2 42.67,44.2 arc71 44.2,43.69 44.7,43.69 arc99 46.23,45.47 arc-93 48.77,48.77 62.23,48.77 arc-42 71.6,45.16 U$6.34
J2Y
  Top 0.229: U3.V2 50.55,36.58 arc-101 50.8,39.88 arc102 51.05,43.69 arc-138 52.07,46.23 56.9,46.23 arc-45 68.1,41.6 U$6.44
J3S  (via drill 0.6)
  Top 0.229: U$6.11 82.93,43.05 arc78 82.98,43.56 arc-80 83.03,44.02 arc-10 83.92,44.73 arc-63 v85.34,44.78 | U1.B1A arc-87 100.84,23.11 92.96,34.04 arc-55 92.71,35.81 arc76 91.19,42.16 v90.17,43.18
  Bottom 0.229: v85.34,44.78 arc4 v90.17,43.18
J3X  (via drill 0.6)
  Top 0.229: U1.V2 119.63,36.83 arc-32 v115.32,42.93 | v111.76,42.93 110.24,43.43 arc-7 107.7,44.45 arc-62 106.68,45.97 arc85 105.41,47.24 95.5,47.24 arc27 90.17,45.97 arc12 84,41.99 U$6.8
  Bottom 0.229: v111.76,42.93 v115.32,42.93
J4S  (via drill 0.6)
  Top 0.229: U$6.10 83.52,42.93 arc28 v84.12,43.81 | U2.B1A arc-27 129.29,11.94 arc-6 126.52,12.09 arc-85 124.21,14.99 arc36 123.44,18.03 arc87 112.52,20.83 arc-73 100.56,22.4 92.23,33.76 arc-70 91.95,36.58 arc54 92.2,38.61 arc35 v88.9,42.42
  Bottom 0.229: v88.9,42.42 v84.12,43.81
J4X
  Top 0.229: U2.H2 125.73,17.27 124.46,18.8 arc44 113.54,24.64 arc-82 109.73,28.7 arc25 108.46,33.53 arc-5 106.93,36.58 arc-27 105.66,43.43 arc96 102.87,46.23 96.27,46.23 arc28 90.17,44.7 arc8 84.68,41.27 U$6.6
J4Y  (via drill 0.6)
  Top 0.229: U2.V2 136.65,27.43 arc56 126.75,32.26 arc19 121.92,31.24 arc-32 119.38,30.99 arc-4 v115.82,31.75 | v112.27,33.02 arc-63 106.43,41.91 arc5 106.17,45.21 arc92 104.14,46.74 95.76,46.74 arc29 89.92,45.21 arc7 84.3,41.6 U$6.7
  Bottom 0.229: v112.27,33.02 arc11 v115.82,31.75
LCDD4
  Top 0.229: U$4.27 arc12 71.88,26.92 arc-77 71.86,27.71 arc-5 72.11,28.27 arc-5 72.47,28.98 arc-19 72.77,29.36 arc6 U$6.70
LCDD5
  Top 0.229: U$4.25 arc4 71.17,27 arc-64 71.25,27.86 arc25 71.7,28.85 arc-37 72.03,29.34 U$6.69
LCDD6
  Top 0.229: U$4.23 arc-8 74.17,19.05 70.51,27.13 arc-73 70.71,28.09 arc48 71.22,28.98 arc-54 71.58,29.57 U$6.68
LCDD7
  Top 0.229: U$4.21 arc-10 69.85,27.69 arc-47 70.43,28.63 arc58 70.69,29.13 arc-52 70.94,29.67 U$6.67
LCDDRIVE  (via drill 0.6)
  Top 0.229: v103.12,12.19 104.39,10.92 arc43 116.08,5.84 arc-6 U$11.2
  Bottom 0.305: v103.12,12.19 100.84,12.19 arc-90 100.33,12.7 100.33,15.24 arc90 99.57,16.76 96.01,18.54 arc16 92.96,19.56 arc103 90.93,17.78 arc-1 U$4.35
LCDE
  Top 0.229: U$4.29 arc27 82.04,17.27 72.62,26.92 arc-96 72.44,27.69 arc-3 72.64,28.14 arc4 72.8,28.5 arc-22 73.1,28.98 arc-4 U$6.71
LCDLED  (via drill 0.6)
  Top 0.305: U$10.2 106.68,6.86 arc22 v103.38,8.89
  Bottom 0.305: v103.38,8.89 100.84,8.89 arc-74 99.82,9.65 arc39 U$4.39
LCDR/W
  Top 0.229: U$4.31 arc24 84.07,17.53 73.36,26.98 arc-93 73.41,27.84 arc-6 73.81,28.27 arc3 U$6.73
LCDRS
  Top 0.229: U$4.33 arc27 86.13,17.93 74.4,26.77 arc-97 74.14,27.91 U$6.74
MCLR
  Top 0.229: U$6.13 82.22,43.76 82.7,44.53 arc-22 84,45.41 arc-1 R2.2
N$1  (via drill 0.6)
  Top 0.229: U$6.78 78.72,28.14 arc-46 78.99,27.43 v78.23,25.15 | v75.95,17.02 77.19,15.29 77.01,13.92 77.17,12.6 77.04,11.53 76.2,9.65 76.2,7.37 arc90 77.22,6.35 arc-67 77.98,5.84 arc42 U$12.17
  Bottom 0.229: v75.95,17.02 v78.23,25.15
N$3
  Top 0.229: C12.1 U$2.3
N$4  (via drill 0.6)
  Top 0.229: R3.1 86.11,47.24 arc-74 R2.1 v89.71,47.4 | v93.73,44.7 95.25,43.69 arc-39 96.01,42.67 arc-1 100.33,29.21 arc-40 JPPROG.5
  Bottom 0.229: v93.73,44.7 v89.71,47.4
N$5  (via drill 0.6)
  Top 0.229: U$6.80 79.4,28.88 arc-62 79.65,28.22 arc9 v79.27,24.18 | U$12.18 v77.06,9.55
  Bottom 0.229: v79.27,24.18 arc-9 77.19,15.29 77.01,13.92 77.17,12.6 77.04,11.53 v77.06,9.55
N$6  (via drill 0.6)
  Top 0.229: U$6.81 79.78,29.21 arc-40 80.26,28.19 v80.26,25.4 | v78.66,16.61 79.58,15.21 79.76,13.56 79.55,12.78 79.73,11.33 78.99,10.16 arc85 79.25,8.89 arc-28 80.54,7.44 80.42,6.22 arc69 80.77,5.59 arc-53 U$12.15
  Bottom 0.229: v80.26,25.4 80.26,23.88 v78.66,16.61
N$7  (via drill 0.6)
  Top 0.229: U$6.17 79.7,44.07 arc-70 78.99,43.94 arc-18 v78.23,44.45 | v56.9,22.86 arc103 57.91,17.27 arc-56 59.26,15.24 59.38,13.89 arc56 U$4.12 R7.2
  Bottom 0.229: v78.23,44.45 77.72,43.94 77.27,43.08 75.74,41.55 arc-90 74.62,41.58 arc-28 73.99,42.65 arc73 73,43.41 arc88 55.63,24.64 arc50 56.13,23.62 arc-14 v56.9,22.86
N$9  (via drill 0.6)
  Top 0.229: U$6.82 80.14,29.54 arc-48 81.28,26.42 v81.03,22.86 | v79.96,9.8 80.52,9.4 arc-61 U$12.16
  Bottom 0.229: v81.03,22.86 79.58,15.21 79.76,13.56 79.55,12.78 79.73,11.33 v79.96,9.8
N$10  (via drill 0.6)
  Top 0.229: U$6.29 73.33,46.97 arc63 v72.14,47.24 | v58.42,22.1 61.72,19.3 arc-36 64.34,15.06 64.52,13.74 arc57 U$4.16
  Bottom 0.229: v72.14,47.24 arc28 66.55,43.69 arc-7 64.52,41.91 arc6 61.21,39.12 arc48 54.86,24.13 arc118 v58.42,22.1
N$11  (via drill 0.6)
  Top 0.229: U$6.83 80.47,29.92 arc-40 82.04,26.42 v82.04,24.38 | v81.03,16.76 82.04,15.75 82.19,15.04 82.14,13.95 82.22,12.68 82.12,11.35 82.04,9.4 82.91,7.62 83.13,6.33 U$12.13
  Bottom 0.229: v82.04,24.38 82.04,22.61 v81.03,16.76
N$12  (via drill 0.6)
  Top 0.229: U$6.84 80.87,30.23 arc-43 82.8,25.65 v83.06,21.84 | U$12.14 v83.06,9.65
  Bottom 0.229: v83.06,21.84 82.04,15.75 82.19,15.04 82.14,13.95 82.22,12.68 82.12,11.35 v83.06,9.65
N$13  (via drill 0.6)
  Top 0.229: U$6.28 73.74,47.27 arc43 v70.76,48.36 | v57.66,20.57 60.45,18.29 arc-31 U$4.13
  Bottom 0.229: v70.76,48.36 65.53,43.69 arc-2 61.72,40.39 arc50 54.1,23.88 arc93 v57.66,20.57
N$14  (via drill 0.6)
  Top 0.229: U$6.50 65.89,39.57 arc147 v61.72,37.34 | v58.67,23.62 59.69,22.35 arc18 62.74,19.56 arc-50 U$4.15
  Bottom 0.229: v61.72,37.34 arc-65 60.2,33.27 arc7 58.42,31.75 arc42 56.9,28.45 arc-1 56.64,25.15 arc90 57.91,23.62 arc11 v58.67,23.62
N$15  (via drill 0.6)
  Top 0.229: U$6.89 82.63,32 arc-61 83.57,28.19 v83.82,23.62 | v83.36,16.99 84.66,15.27 84.78,13.82 84.63,12.68 84.84,11.28 84.58,9.4 85.62,7.64 85.52,6.22 U$12.11
  Bottom 0.229: v83.82,23.62 83.92,21.79 arc5 v83.36,16.99
N$16  (via drill 0.6)
  Top 0.229: U$6.90 83.01,32.33 arc-43 84.33,29.21 v84.86,20.75 | U$12.12 v85.75,9.68
  Bottom 0.229: v84.86,20.75 84.66,15.24 84.78,13.82 84.63,12.68 84.84,11.28 v85.75,9.68
N$17  (via drill 0.6)
  Top 0.229: U$6.91 83.34,32.72 arc-43 84.84,29.21 v85.6,22.86 | v85.85,16.76 87.33,15.27 87.2,13.89 87.35,12.8 87.17,11.3 87.12,9.65 88.04,7.52 88.19,6.33 U$12.9
  Bottom 0.229: v85.6,22.86 85.75,21.08 v85.85,16.76
N$18  (via drill 0.6)
  Top 0.229: U$6.92 83.67,33.1 arc-43 85.37,29.21 86.46,23.09 v86.87,18.8 | U$12.10 v88.21,9.63
  Bottom 0.229: v86.87,18.8 87.33,15.27 87.2,13.89 87.35,12.8 87.17,11.3 v88.21,9.63
N$19
  Top 0.229: U$6.93 84.07,33.4 arc-40 85.88,29.59 87.38,22.1 89.71,15.19 89.89,13.89 89.74,12.65 89.86,11.25 89.41,9.4 90.7,7.64 90.6,6.22 U$12.7
N$20  (via drill 0.6)
  Top 0.229: U$6.94 84.43,33.76 arc-33 86.36,30.23 v89.66,18.54 | U$12.8 v90.68,9.45
  Bottom 0.229: v89.66,18.54 89.71,15.19 89.89,13.89 89.74,12.65 89.86,11.25 v90.68,9.45
N$21
  Top 0.229: U$6.96 85.11,34.47 arc-26 85.85,33.27 arc-1 86.64,30.99 90.68,18.8 92.38,15.14 92.3,14.05 92.41,12.65 92.25,11.38 arc48 92.66,8.89 arc-51 93.19,7.16 arc57 U$12.5
N$23  (via drill 0.6)
  Top 0.229: U$6.97 85.47,34.82 arc-30 86.36,33.27 v92.2,18.29 | U$12.6 v93.55,9.5
  Bottom 0.229: v92.2,18.29 92.38,15.14 92.3,14.05 92.41,12.65 92.25,11.38 arc104 v93.55,9.5
N$24
  Top 0.229: U$6.98 85.78,35.23 arc-20 86.61,34.04 93.14,19.51 arc42 94.28,18.11 96.27,17.02 arc-28 97.54,15.75 arc-34 97.79,14.73 97.79,11.18 arc-59 96.77,9.4 arc45 96.01,8.38 95.76,7.29 95.68,6.27 arc79 U$12.3
N$25
  Top 0.229: U$6.99 86.13,35.59 arc-15 87.12,34.29 93.73,20.57 arc33 96.01,18.03 arc-18 97.79,16.51 arc-28 98.37,15.32 98.37,10.92 arc-35 U$12.4
N$26  (via drill 0.6)
  Top 0.229: U$6.100 86.61,35.81 v87.63,36.07 | U5.B1A arc39 148.59,37.85 v147.83,20.07 | v148.01,15.93 arc-39 126.24,11.18 arc-85 123.44,14.48 arc97 116.59,21.08 arc24 112.27,19.81 arc-30 107.95,18.8 arc-42 99.57,22.35 92.71,31.75 arc-27 90.93,34.54 arc-13 v90.42,36.83
  Bottom 0.229: v148.01,15.93 v147.83,20.07 | v87.63,36.07 arc11 v90.42,36.83
N$27  (via drill 0.6)
  Top 0.229: R1.1 U$12.21 arc36 75.18,5.84 arc30 75.44,8.38 v75.18,9.91 | U$6.88 82.25,31.67 arc-70 v82.8,29.16
  Bottom 0.229: v82.8,29.16 arc-48 78.05,26.01 arc68 77.17,24.97 74.5,15.21 74.62,13.82 74.52,12.65 74.6,11.48 v75.18,9.91
N$28  (via drill 0.6)
  Top 0.229: R10.1 U$12.23 arc75 72.92,6.4 72.82,7.52 74.6,11.46 74.52,12.65 74.62,13.82 74.5,15.24 v73.66,17.02 | U$6.87 81.94,31.29 arc-84 82.09,30.61 v81.99,30.35
  Bottom 0.229: v81.99,30.35 81.28,29.46 arc-46 77.72,26.42 arc67 76.71,25.15 74.68,17.78 arc-75 v73.66,17.02
N$29  (via drill 0.6)
  Top 0.229: R9.1 U$12.25 70.28,6.4 70.38,7.39 v71.12,12.19 | U$6.77 78.36,27.79 arc-75 78.41,27.36 arc-106 v76.71,27.18
  Bottom 0.229: v76.71,27.18 76.2,26.16 74.68,19.94 72.9,17.53 72.08,15.09 71.93,14.07 v71.12,12.19
N$30  (via drill 0.6)
  Top 0.229: R15.1 U$12.27 67.87,6.4 67.74,7.32 67.82,7.87 arc50 69.85,11.68 arc-56 70.61,12.95 arc12 71.37,13.54 71.93,14.07 72.08,15.09 v71.37,16.76 | U$6.76 77.06,28.37 76.28,27.99 arc22 v75.44,27.2
  Bottom 0.229: v71.37,16.76 74.19,20.27 v75.44,27.2
N$31
  Top 0.229: U1.H2 109.73,46.99 arc43 107.95,47.75 95.25,47.75 arc29 89.41,46.23 arc9 83.64,42.34 arc12 U$6.9
N$32  (via drill 0.6)
  Top 0.229: U$6.47 66.93,40.66 arc104 59.44,39.88 arc-4 51.31,27.94 arc-58 45.21,25.91 arc75 30.73,16.51 arc-86 22.86,11.68 arc-57 9.4,24.64 arc1 v8.64,26.92 | v7.11,30.73 U6.B1A
  Bottom 0.229: v8.64,26.92 v7.11,30.73
N$33  (via drill 0.6)
  Top 0.229: v67.92,31.01 U$6.61 | v69.72,29.13 arc1 U$6.66
  Bottom 0.229: v67.92,31.01 arc-93 65.02,30.48 arc65 61.34,31.5 arc88 59.33,28.6 arc7 59.92,23.44 arc44 61.21,21.59 arc42 68.1,21.26 arc77 69.93,24.13 arc31 68.83,26.67 arc-75 v69.72,29.13
N$39  (via drill 0.6)
  Top 0.229: U$6.1 85.39,38.46 84.73,38.25 83.95,37.95 v82.09,36.6 | v60.2,16.76 58.67,18.03 arc6 R6.1
  Bottom 0.229: v82.09,36.6 80.87,35.18 77.57,34.19 74.4,29.82 arc49 73.25,24.16 arc-24 73.28,22.66 arc-66 67.69,16.97 arc-21 v60.2,16.76 58.93,16 arc57 U$4.9
N$40  (via drill 0.6)
  Top 0.229: U$6.3 84.45,38.91 82.7,38.35 81.43,37.29 v80.54,36.22 | v66.42,17.68 66.98,15.29 66.9,13.95 67,12.65 66.88,11.46 arc-78 v65.53,9.4 | v58.93,9.4 52.83,10.16 arc-80 U$4.4
  Bottom 0.229: v80.54,36.22 arc-38 79.17,35.33 77.24,34.72 75.44,32.26 73.66,29.72 arc17 72.9,28.19 arc31 72.72,24 arc-27 72.39,21.61 arc-65 v66.42,17.68 | v58.93,9.4 v65.53,9.4
N$41  (via drill 0.6)
  Top 0.229: U$6.12 81.41,42.24 arc-13 v79.73,39.09 | v54.36,17.91 54.18,15.09 54.33,13.97 arc-84 U$4.6
  Bottom 0.229: v79.73,39.09 arc63 78.26,37.72 arc-72 77.34,37.08 arc35 76.3,36.3 71.93,29.74 arc47 70.99,24.64 arc-88 68.33,20.14 arc-19 63.55,19.68 55.42,18.47 arc66 v54.36,17.91
N$42  (via drill 0.6)
  Top 0.229: U$6.4 84.18,39.34 82.37,38.99 80.85,37.59 79.65,36.63 v78.89,36.12
  Bottom 0.229: v78.89,36.12 78.28,36.09 arc27 76.63,34.92 73.28,30.05 arc46 72.14,24.38 arc-85 69.09,19.3 arc-17 63.75,18.54 arc50 U$4.7
N$43  (via drill 0.6)
  Top 0.229: U$6.14 80.7,42.95 arc30 80.16,41.83 v77.32,38.02
  Bottom 0.229: v77.32,38.02 76.05,36.96 71.12,29.46 arc46 70.36,25.15 arc-29 70.28,22.61 arc-62 68.17,20.65 arc-16 63.5,20.32 53.9,18.92 arc56 U$4.3
N$44  (via drill 0.6)
  Top 0.229: U$6.5 83.9,39.78 81.97,39.65 80.44,38.23 v79.35,37.47 | v56.72,17.09 56.79,14.96 56.74,13.82 arc74 U$4.10
  Bottom 0.229: v79.35,37.47 78.31,36.85 arc-17 77.24,36.42 arc33 76.58,35.74 73.1,30.66 arc3 72.42,29.62 arc44 71.55,24.43 arc-84 68.94,19.79 arc-23 63.48,19.13 57.73,18.21 arc38 v56.72,17.09
N$59  (via drill 0.6)
  Top 0.229: U$6.56 68.86,35.33 arc97 68.83,35.81 67.18,37.44 arc37 66.57,37.44 arc78 v63.5,37.08 | v57.89,26.36 56.9,25.65 arc19 55.88,24.64 53.85,21.59 arc-35 50.04,18.54 arc54 43.69,11.43 arc30 43.69,9.65 arc13 43.94,6.35 arc-35 R11.2 44.7,3.56 arc53 45.47,3.05 arc-3 49.71,3 52.32,3 arc92 U$12.37
  Bottom 0.229: v63.5,37.08 arc-62 61.47,33.53 arc11 58.93,31.5 arc50 57.91,28.45 v57.89,26.36
N$60  (via drill 0.6)
  Top 0.229: U$6.57 69.24,35.03 arc91 69.22,36.32 67.51,37.9 arc49 66.95,37.97 arc-61 66.45,38.15 arc60 v64.77,38.86 | U$12.39 R12.2 arc-16 44.96,10.92 arc-67 49.53,17.53 arc15 51.56,18.54 arc9 53.34,19.81 arc26 54.86,21.84 arc-42 v57.66,24.64
  Bottom 0.229: v64.77,38.86 64.77,38.1 arc-51 62.23,32.77 arc-16 60.71,32 arc71 58.62,28.96 arc-7 58.88,25.91 arc-57 v57.66,24.64
N$61
  Top 0.229: U$6.58 68.35,33.4 arc-54 65.79,32.51 arc-1 64.01,32.77 arc-5 62.74,33.02 arc68 59.94,32 arc1 58.67,30.23 53.34,23.11 arc-30 48.54,19.23 arc48 40.39,10.41 arc-18 R13.2 37.85,3.05 arc49 40.39,2.03 55.63,2.03 arc75 U$12.33
N$62
  Top 0.229: U$6.59 68.63,32.99 arc-54 65.53,32 62.48,32.51 arc67 60.2,31.5 arc-2 59.44,30.48 53.34,22.1 arc-31 49.53,19.05 arc49 41.66,10.41 arc20 R14.2 arc71 42.24,2.79 45.41,2.52 53.65,2.52 arc67 U$12.35
OSC1
  Top 0.229: U$6.63 70.1,31.65 arc-12 R5.1 U$3.1 C8.1
OSC2
  Top 0.229: U$6.64 70.51,31.34 arc11 R5.2 U$3.2 C7.1
P1
  Top 0.229: U6.V2 16.51,33.53 18.54,35.31 arc-43 25.65,37.85 arc28 46.74,42.42 arc70 48.26,45.21 arc-97 50.55,47.75 56.13,47.75 arc-51 69.14,42.67 U$6.41
P2
  Top 0.229: U6.H2 26.92,42.67 arc-23 35.05,43.69 arc-3 42.93,42.93 arc23 45.97,43.18 arc83 47.24,45.21 arc-99 49.78,48.26 61.72,48.26 arc-40 71.25,44.81 U$6.35
P3
  Top 0.229: JP1.2 36.32,51.05 arc78 38.86,49.28 62.48,49.28 arc-41 71.37,45.97 arc-7 U$6.33
P4
  Top 0.229: JP2.2 45.72,51.05 arc54 48.77,49.78 62.99,49.78 arc-46 U$6.32
P5
  Top 0.229: JP3.2 54.61,51.05 arc52 56.39,50.29 61.72,50.29 arc-23 71.63,49.02 arc-8 73.15,48.26 arc-26 U$6.27
P6
  Top 0.229: JP4.2 63.75,51.31 arc27 65.28,50.8 arc-19 72.64,49.28 arc-28 U$6.26
P7  (via drill 0.6)
  Top 0.229: v74.17,49.78 JP5.2 | v77.95,49.73 arc-140 78.49,48.77 arc-19 U$6.25 | JPPROG.2 96.27,34.8 arc31 v94.74,42.16
  Bottom 0.229: v74.17,49.78 arc41 v77.95,49.73 arc-5 84.33,48.26 arc-50 91.19,43.43 arc51 92.2,42.67 v94.74,42.16
P8  (via drill 0.6)
  Top 0.229: JP6.2 80.52,51.56 arc-19 79.76,49.78 arc-20 U$6.24 | JPPROG.1 94.49,36.32 arc41 v91.95,44.2
  Bottom 0.229: JP6.2 arc76 82.8,49.78 arc-15 89.15,46.74 arc-18 v91.95,44.2
P9
  Top 0.229: JP7.2 89.41,51.82 arc-103 88.14,50.8 84.84,50.8 arc51 80.01,48.51 78.61,47.22 U$6.23
P10
  Top 0.229: JP8.2 98.04,51.56 arc-59 95.5,50.29 85.34,50.29 arc39 81.03,48.77 78.99,46.89 U$6.22
P11
  Top 0.229: JP9.2 106.43,51.31 arc-43 102.62,49.78 86.11,49.78 arc44 80.52,47.55 79.38,46.56 U$6.21
P12
  Top 0.229: JP10.2 115.06,51.05 arc-40 110.49,49.28 87.12,49.28 arc45 79.76,46.23 arc-1 U$6.20
P13
  Top 0.229: U5.V2 136.4,51.31 arc-80 133.6,51.05 arc57 123.95,52.07 arc-15 111.51,48.77 87.88,48.77 arc40 80.21,45.97 arc9 U$6.19
P14
  Top 0.229: U5.H2 125.48,42.67 arc-7 120.4,44.45 arc-39 117.86,46.74 arc61 115.32,48.26 87.88,48.26 arc40 80.47,45.54 arc10 U$6.18
PROGCAP
  Bottom 0.305: C11.2 JPPROG.6
RESET
  Top 0.229: U$6.51 65.79,35.81 arc-75 63.75,35.56 arc79 58.93,34.82 arc7 51.56,25.4 arc-41 45.72,21.34 arc12 JPSPI.5
SCK
  Top 0.229: U$6.55 67.23,34.42 arc-64 63.27,33.4 arc76 59.28,31.98 53.09,23.62 arc-31 48.01,19.56 arc27 41.91,14.99 JPSPI.1
SDI
  Top 0.229: U$6.54 66.85,34.75 arc-64 63.4,33.93 arc74 58.93,32.46 52.83,24.13 arc-28 48.26,20.32 arc23 37.85,12.45 arc-6 JPSPI.2
SDO
  Top 0.229: U$6.53 66.57,35.18 arc-65 63.45,34.49 arc75 58.7,32.99 52.58,24.64 arc-28 48.01,20.83 arc16 JPSPI.3
VDDCORE  (via drill 0.6)
  Top 0.229: U$6.85 79.96,31.85 arc44 v78.84,32.18
  Bottom 0.229: C6.2 arc-3 v78.84,32.18

### Text on the board
bPlace: ^
tNames: pumptest